# Altium schematic sheet m1.SchDoc
size B; SheetNumber: 1; SheetTotal: 1
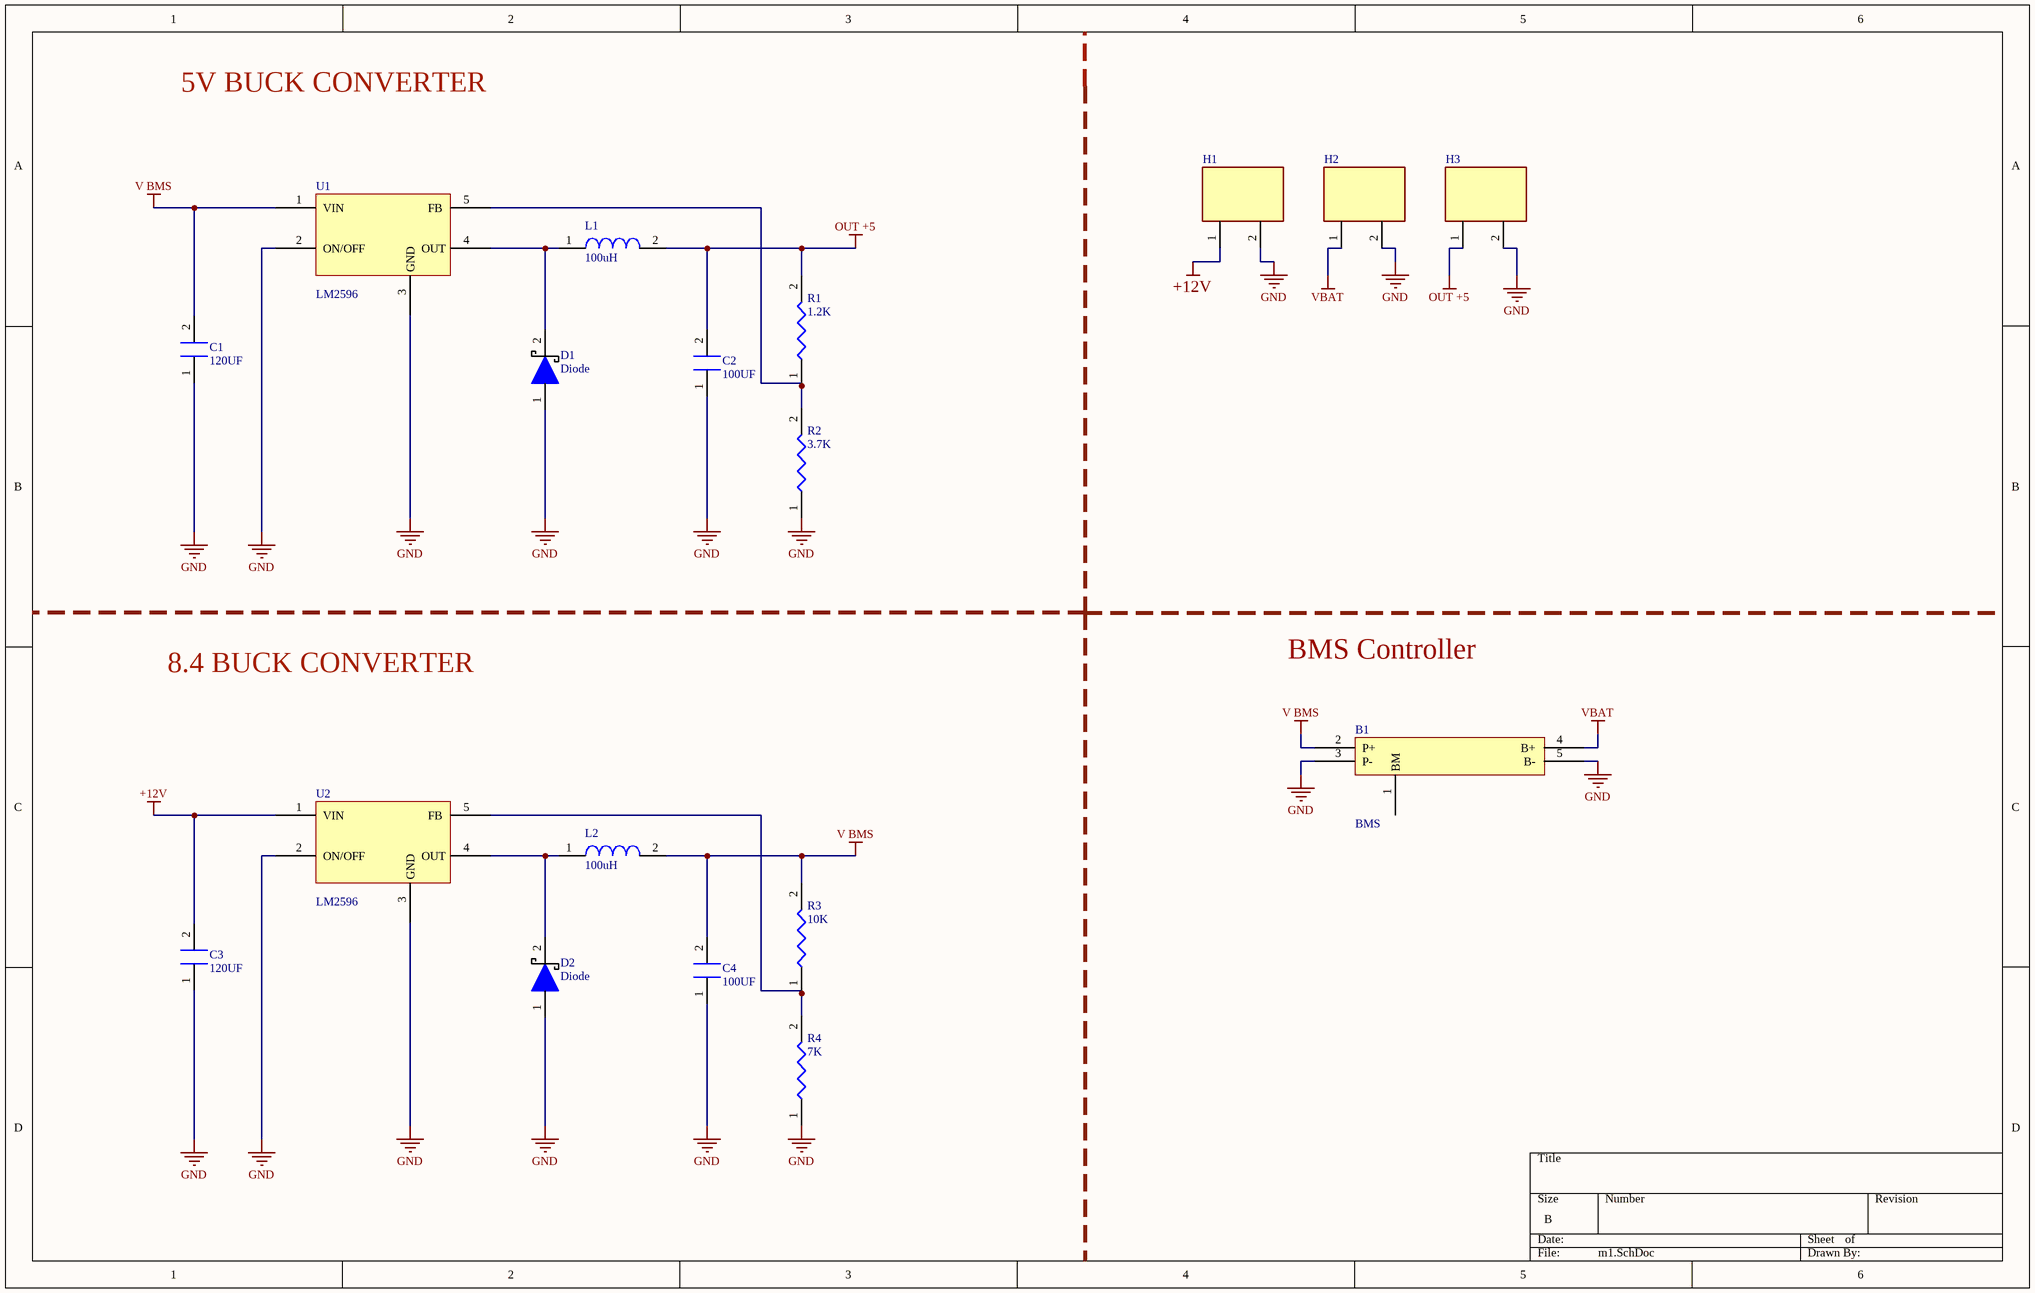
[diagram p0: m1.SchDoc]

## Parts
B1  BMS
C1  120UF  [CAPACITOR]
C2  100UF  [CAPACITOR]
C3  120UF  [CAPACITOR]
C4  100UF  [CAPACITOR]
D1  Diode  [DIODE]
D2  Diode  [DIODE]
H1  Header  [HEADER]  (value not drawn)
H2  Header  [HEADER]  (value not drawn)
H3  Header  [HEADER]  (value not drawn)
L1  100uH  [Inductor]
L2  100uH  [Inductor]
R1  1.2K  [Resistor]
R2  3.7K  [Resistor]
R3  10K  [Resistor]
R4  7K  [Resistor]
U1  LM2596  [LM2595]
U2  LM2596  [LM2595]

## Nets
+12V: C3.2 H1.1 U2.1(VIN)
GND: B1.3(P-) B1.5(B-) C1.1 C2.1 C3.1 C4.1 D1.1 D2.1 H1.2 H2.2 H3.2 R2.1 R4.1 U1.2(ON/OFF) U1.3(GND) U2.2(ON/OFF) U2.3(GND)
OUT +5: C2.2 H3.1 L1.2 R1.2
V BMS: B1.2(P+) C1.2 C4.2 L2.2 R3.2 U1.1(VIN)
VBAT: B1.4(B+) H2.1
NetD1_2: D1.2 L1.1 U1.4(OUT)
NetD2_2: D2.2 L2.1 U2.4(OUT)
NetR1_1: R1.1 R2.2 U1.5(FB)
NetR3_1: R3.1 R4.2 U2.5(FB)

Not connected (* = marked no-connect by the designer): B1 1(BM)

## Notes on the sheet
- 5V BUCK CONVERTER
- 8.4 BUCK CONVERTER
- BMS Controller

## Library data of the parts
C1-C4 = Capacitor
L1 L2 = Inductor
R1-R4 = Resistor